# Altium schematic sheet 06_RK3128_USB_ADC_Crystal.SchDoc
size 297 x 209 mm
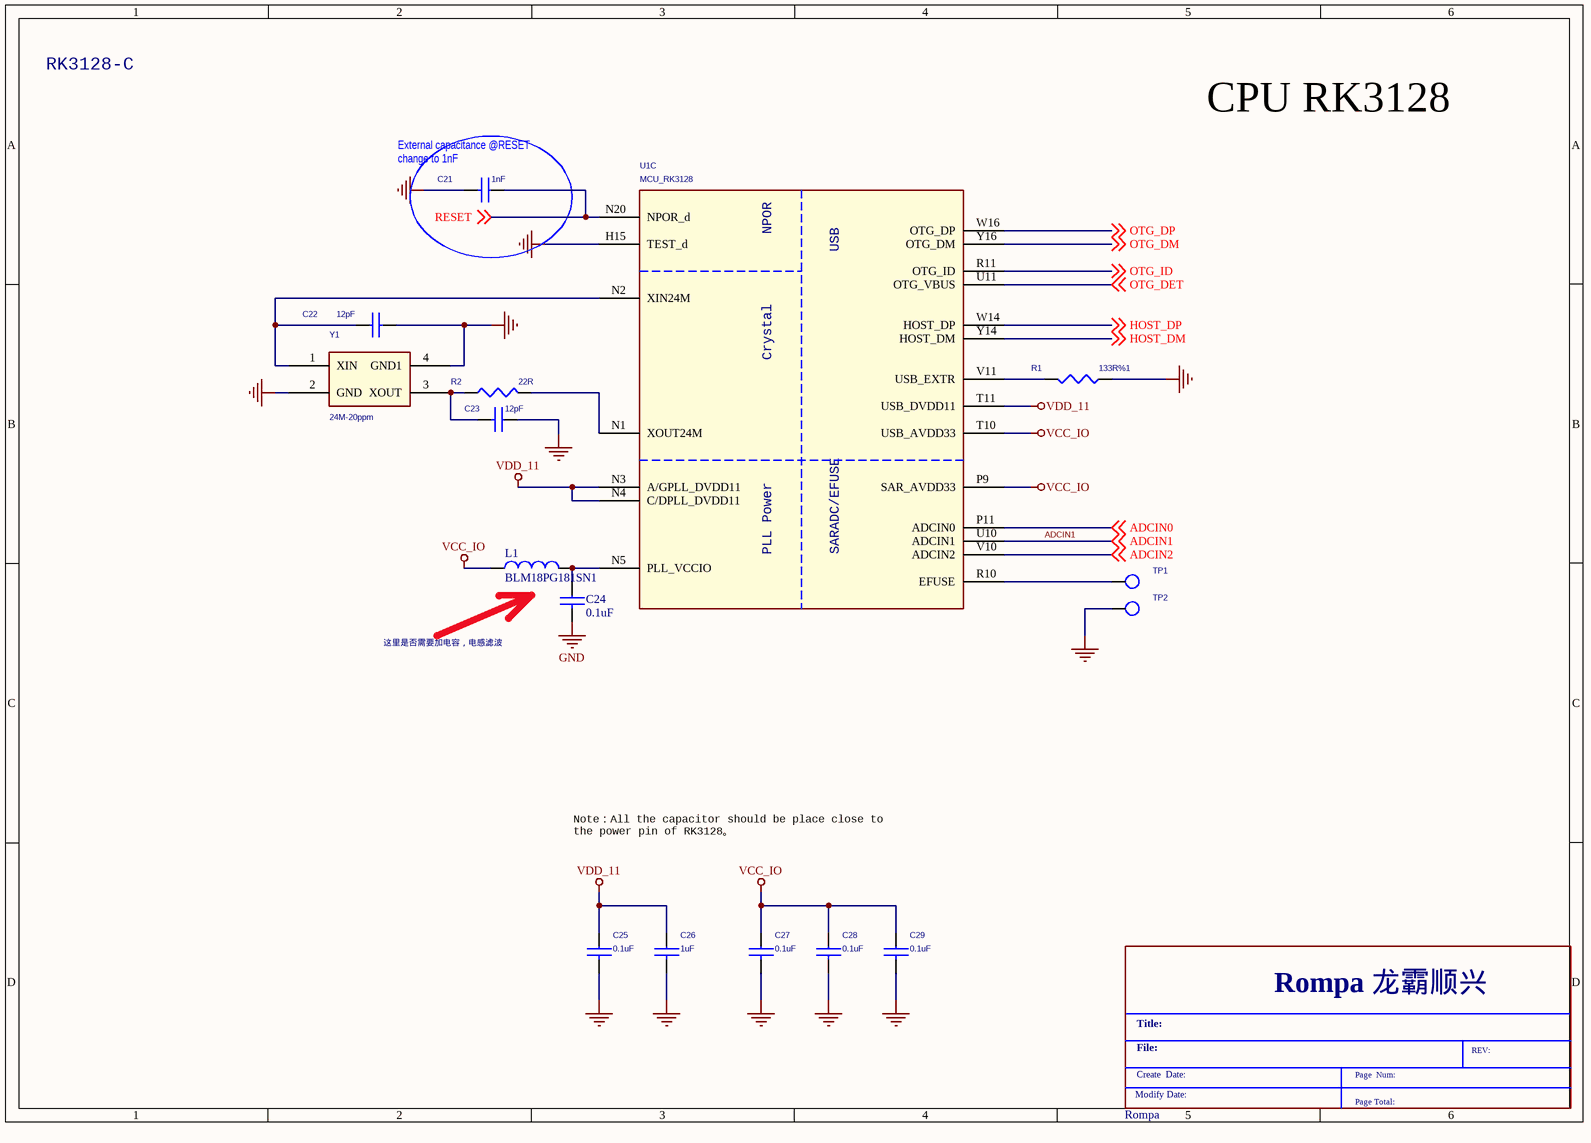
[diagram p0: 06_RK3128_USB_ADC_Crystal.SchDoc]

## Parts
*  Rompa  (graphical)
C21  1nF  [C0402]
C22  12pF  [C0402]
C23  12pF  [C0402]
C24  0.1uF  [C0402]
C25  0.1uF  [C0402]
C26  1uF  [C0402]
C27  0.1uF  [C0402]
C28  0.1uF  [C0402]
C29  0.1uF  [C0402]
L1  BLM18PG181SN1  [L0603]
R1  133R%1  [R0402]
R2  22R  [R0402]
TP1  TEST  [TEST]  (value not drawn)
TP2  TEST  [TEST]  (value not drawn)
U1  MCU_RK3128  [BGA316-14X14-0.65]  (part C of 12)
Y1  24M-20ppm  [CRY-3225]

## Nets
GND: C21.2 C22.2 C23.1 C24.2 C25.2 C26.2 C27.2 C28.2 C29.2 R1.1 TP2.1 U1.H15(TEST_d) Y1.2(GND) Y1.4(GND1)
VCC_IO: C27.1 C28.1 C29.1 L1.1 U1.P9(SAR_AVDD33) U1.T10(USB_AVDD33)
VDD_11: C25.1 C26.1 U1.N3(A/GPLL_DVDD11) U1.N4(C/DPLL_DVDD11) U1.T11(USB_DVDD11)
ADCIN0: U1.P11(ADCIN0) ; off-sheet ADCIN0
ADCIN1: U1.U10(ADCIN1) ; off-sheet ADCIN1
ADCIN2: U1.V10(ADCIN2) ; off-sheet ADCIN2
HOST_DM: U1.Y14(HOST_DM) ; off-sheet HOST_DM
HOST_DP: U1.W14(HOST_DP) ; off-sheet HOST_DP
OTG_DET: U1.U11(OTG_VBUS) ; off-sheet OTG_DET
OTG_DM: U1.Y16(OTG_DM) ; off-sheet OTG_DM
OTG_DP: U1.W16(OTG_DP) ; off-sheet OTG_DP
OTG_ID: U1.R11(OTG_ID) ; off-sheet OTG_ID
RESET: C21.1 U1.N20(NPOR_d) ; off-sheet RESET
NetC22_1: C22.1 U1.N2(XIN24M) Y1.1(XIN)
NetC23_2: C23.2 R2.1 Y1.3(XOUT)
NetC24_1: C24.1 L1.2 U1.N5(PLL_VCCIO)
NetR1_2: R1.2 U1.V11(USB_EXTR)
NetR2_2: R2.2 U1.N1(XOUT24M)
NetTP1_1: TP1.1 U1.R10(EFUSE)

## Notes on the sheet
- RK3128-C
- CPU RK3128
- (near C21) External capacitance @RESET
  change to 1nF
- 这里是否需要加电容，电感滤波
- Note：All the capacitor should be place close to
  the power pin of RK3128。
- (in symbol MCU_RK3128, part C) NPOR; USB; Crystal; PLL Power; SARADC/EFUSE
- (in symbol Rompa) Rompa 龙霸顺兴; Title:; File:; REV:; Create  Date:; Page  Num:; Modify Date:; Page Total:

## Library data of the parts
C21 = CAP NP: RoHS CHIP CAP 1nF +10/-10% X5R
C22-C24 = CAP NP
C25 C27-C29 = CAP NP: RoHS CHIP CAP 0.1uF +10/-10% X7R
C26 = CAP NP: RoHS CHIP CAP 1uF +10/-10% X7R
L1 = Inductor: FERRITE BEAD 180 OHM 0603 1LN; Code_IEC: 1005; Published: 8-Jun-2000; LatestRevisionDate: 17-Jul-2002; LatestRevisionNote: Re-released for DXP Platform.; PackageReference: 0402-A; Publisher: Altium Limited; Code_JEITA: 0402
R1 = RES 1B: ROHS CHIP RES 43.2R 1/16W 1%
R2 = RES 1B
TP1 TP2 = TESTPOINT1_0
Y1 = CRYSTAL-4_0